# EAGLE design wachcio_meteo (EAGLE 7.7.0)

## Sheet 1 of 3: urzadzenie
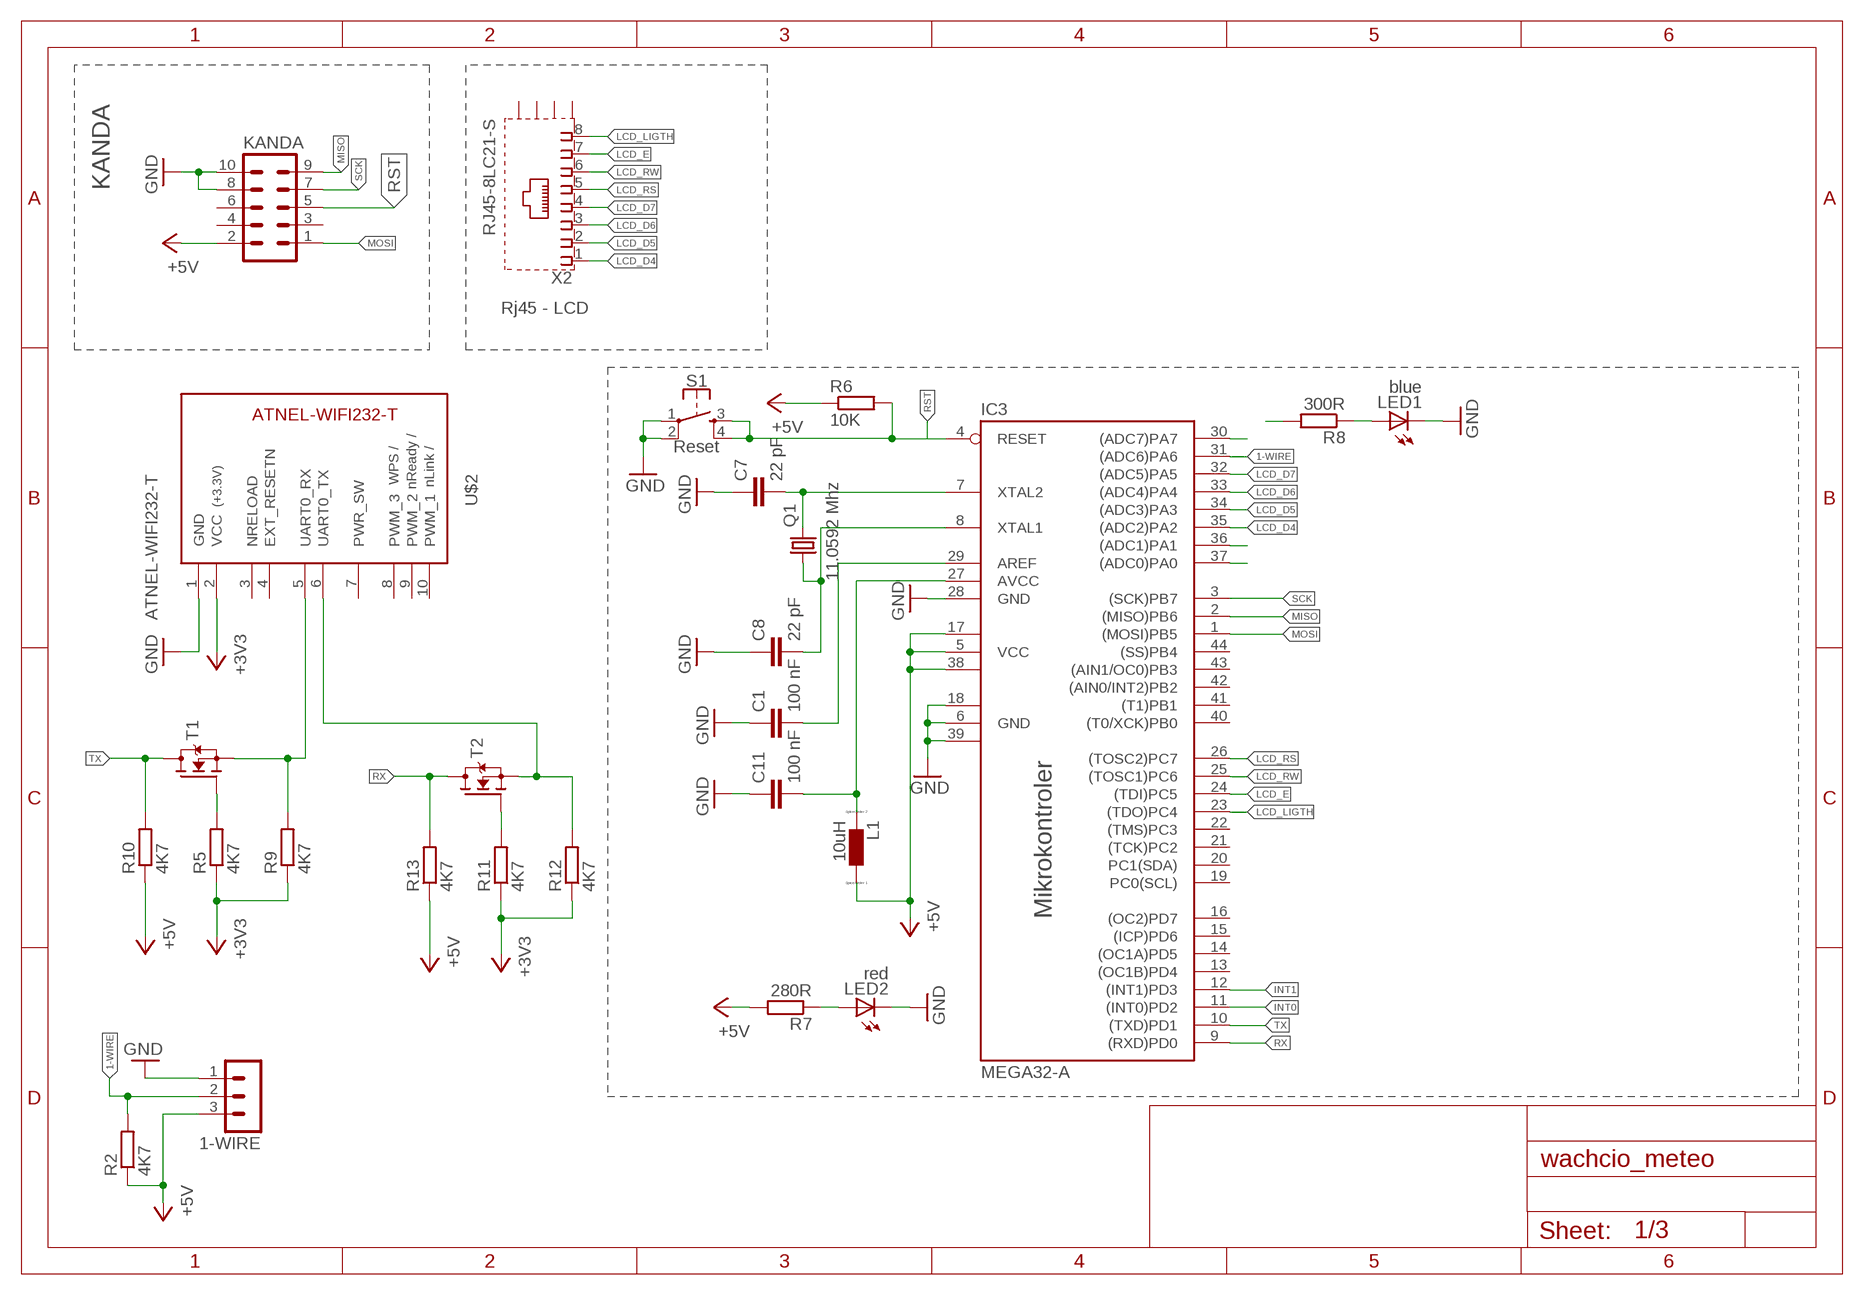
[diagram p0: schematic, sheet 1]

### Parts
1-WIRE  MA03-1  [MA03-1]
C1  100 nF  C-EUC0805  [C0805]
C7  22 pF  C-EUC0805  [C0805]
C8  22 pF  C-EUC0805  [C0805]
C11  100 nF  C-EUC0805  [C0805]
IC3  MEGA32-A  [TQFP44]
KANDA  ML10  [ML10]
L1  10uH  LL3230M  [L3230M]
LED1  blue  LEDCHIPLED_1206  [CHIPLED_1206]
LED2  red  LEDCHIPLED_1206  [CHIPLED_1206]
Q1  11.0592 Mhz  CRYSTALSM49  [SM49]
R2  4K7  R-EU_R1206W  [R1206W]
R5  4K7  R-EU_R1206W  [R1206W]
R6  10K  R-EU_R1206W  [R1206W]
R7  280R  R-EU_R1206W  [R1206W]
R8  300R  R-EU_R1206W  [R1206W]
R9  4K7  R-EU_R1206W  [R1206W]
R10  4K7  R-EU_R1206W  [R1206W]
R11  4K7  R-EU_R1206W  [R1206W]
R12  4K7  R-EU_R1206W  [R1206W]
R13  4K7  R-EU_R1206W  [R1206W]
S1  Reset  MOMENTARY-SWITCH-SPST-2-SMD-4.6X2.8MM  [TACTILE_SWITCH_SMD_4.6X2.8MM]
T1  MOSFET-N-SOT23  [SOT23]
T2  MOSFET-N-SOT23  [SOT23]
U$2  ATNEL-WIFI232-T  [ATNEL-WIFI232-T]
X2  RJ45-8LC21-S  [RJ45-SHIELD1]

### Nets
1-WIRE: 1-WIRE.2 IC3.31((ADC6)PA6) R2.2
+3V3: R5.1 R9.1 R11.1 R12.1 U$2.2(VCC) ; also sheet 2,3
+5V: 1-WIRE.3 IC3.5(VCC) IC3.17(VCC1) IC3.38(VCC2) KANDA.2 L1.1 R2.1 R6.1 R7.2 R10.1 R13.1 ; also sheet 2,3
GND: 1-WIRE.1 C1.1 C7.1 C8.1 C11.1 IC3.6(GND) IC3.18(GND1) IC3.28(GND) IC3.39(GND2) KANDA.8 KANDA.10 LED1.C LED2.C S1.1 S1.2 U$2.1(GND) ; also sheet 2,3
INT0: IC3.11((INT0)PD2)
INT1: IC3.12((INT1)PD3)
LCD_D4: IC3.35((ADC2)PA2) X2.1
LCD_D5: IC3.34((ADC3)PA3) X2.2
LCD_D6: IC3.33((ADC4)PA4) X2.3
LCD_D7: IC3.32((ADC5)PA5) X2.4
LCD_E: IC3.24((TDI)PC5) X2.7
LCD_LIGTH: IC3.23((TDO)PC4) X2.8
LCD_RS: IC3.26((TOSC2)PC7) X2.5
LCD_RW: IC3.25((TOSC1)PC6) X2.6
MISO: IC3.2((MISO)PB6) KANDA.9
MOSI: IC3.1((MOSI)PB5) KANDA.1
N$1: R9.2 T1.2(S) U$2.5(UART0_RX)
N$2: C11.2 IC3.27(AVCC) L1.2
N$3: C1.2 IC3.29(AREF)
N$6: R5.2 T1.1(G)
N$8: IC3.37((ADC0)PA0)
N$9: R12.2 T2.2(S) U$2.6(UART0_TX)
N$10: C7.2 IC3.7(XTAL2) Q1.2
N$11: C8.2 IC3.8(XTAL1) Q1.1
N$12: LED2.A R7.1
N$16: LED1.A R8.1
N$17: R8.2
N$21: IC3.36((ADC1)PA1)
N$22: R11.2 T2.1(G)
N$29: IC3.30((ADC7)PA7)
RST: IC3.4(RESET) KANDA.5 R6.2 S1.3 S1.4
RX: IC3.9((RXD)PD0) R13.2 T2.3(D)
SCK: IC3.3((SCK)PB7) KANDA.7
TX: IC3.10((TXD)PD1) R10.2 T1.3(D)
Unconnected: IC3.13((OC1B)PD4) IC3.14((OC1A)PD5) IC3.15((ICP)PD6) IC3.16((OC2)PD7) IC3.19(PC0(SCL)) IC3.20(PC1(SDA)) IC3.21((TCK)PC2) IC3.22((TMS)PC3) IC3.40((T0/XCK)PB0) IC3.41((T1)PB1) IC3.42((AIN0/INT2)PB2) IC3.43((AIN1/OC0)PB3) IC3.44((SS)PB4) KANDA.3 KANDA.4 KANDA.6 U$2.3(NRELOAD) U$2.4(EXT_RESETN) U$2.7(PWR_SW) U$2.8(PWM_3) U$2.9(PWM_2) U$2.10(PWM_1) X2.S1(S) X2.S2(S) X2.S3(S) X2.S4(S)

### Notes on the sheet
- KANDA
- Rj45 - LCD
- Mikrokontroler

## Sheet 2 of 3: zasilanie
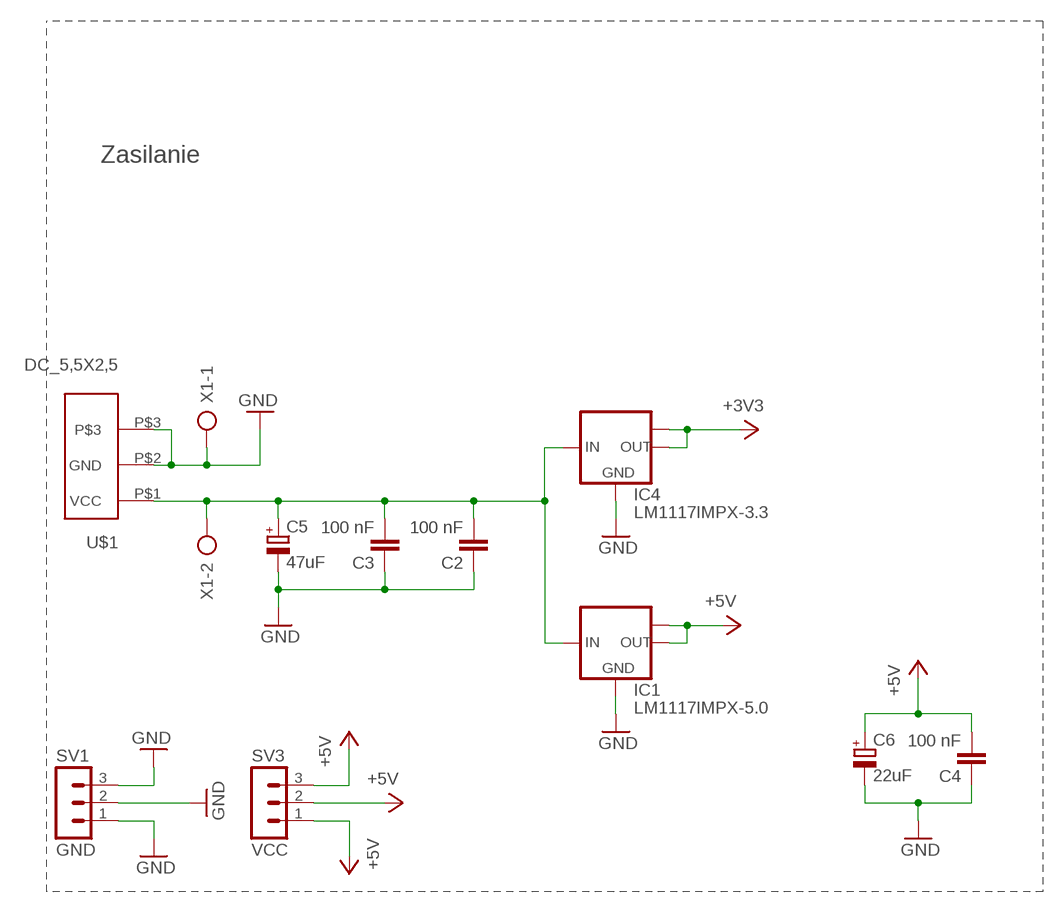
[diagram p1: schematic, sheet 2]

### Parts
C2  100 nF  C-EUC0805  [C0805]
C3  100 nF  C-EUC0805  [C0805]
C4  100 nF  C-EUC0805  [C0805]
C5  47uF  CPOL-EUB45181A  [B45181A]
C6  22uF  CPOL-EUB45181A  [B45181A]
IC1  LM1117IMPX-5.0  [SOT223]
IC4  LM1117IMPX-3.3  [SOT223]
SV1  GND  MA03-1  [MA03-1]
SV3  VCC  MA03-1  [MA03-1]
U$1  DC_5,5X2,5  [DC_5,5X2,5]
X1  AK500/2  [AK500/2]

### Nets
+3V3: IC4.2(OUT) IC4.TAB(OUT1) ; also sheet 1,3
+5V: C4.2 C6.+ IC1.2(OUT) IC1.TAB(OUT1) SV3.1 SV3.2 SV3.3 ; also sheet 1,3
+9V: C2.2 C3.2 C5.+ IC1.3(IN) IC4.3(IN) U$1.P$1(VCC) X1.2
GND: C2.1 C3.1 C4.1 C5.- C6.- IC1.1(GND) IC4.1(GND) SV1.1 SV1.2 SV1.3 U$1.P$2(GND) U$1.P$3 X1.1 ; also sheet 1,3

### Notes on the sheet
- Zasilanie

## Sheet 3 of 3: I2C
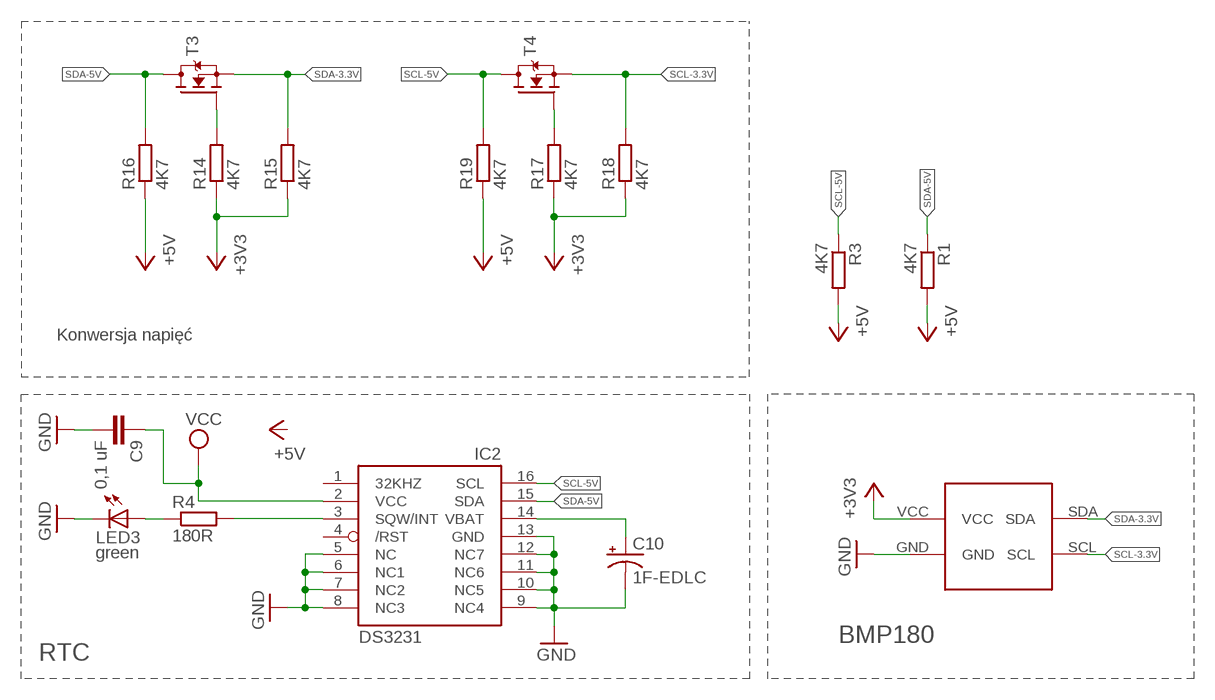
[diagram p2: schematic, sheet 3]

### Parts
C9  0,1 uF  C-EUC0805  [C0805]
C10  1F-EDLC  [CAP-RADIAL-5MM-21.5MM]
IC2  DS3231/SO  [SO16W]
LED3  green  LEDCHIPLED_1206  [CHIPLED_1206]
R1  4K7  R-EU_R1206W  [R1206W]
R3  4K7  R-EU_R1206W  [R1206W]
R4  180R  R-EU_R1206W  [R1206W]
R14  4K7  R-EU_R1206W  [R1206W]
R15  4K7  R-EU_R1206W  [R1206W]
R16  4K7  R-EU_R1206W  [R1206W]
R17  4K7  R-EU_R1206W  [R1206W]
R18  4K7  R-EU_R1206W  [R1206W]
R19  4K7  R-EU_R1206W  [R1206W]
T3  MOSFET-N-SOT23  [SOT23]
T4  MOSFET-N-SOT23  [SOT23]
U$3  BMP180  [BMP180]

### Nets
+3V3: R14.1 R15.1 R17.1 R18.1 U$3.VCC ; also sheet 1,2
+5V: R1.2 R3.2 R16.1 R19.1 ; also sheet 1,2
GND: C9.2 C10.- IC2.5(NC) IC2.6(NC1) IC2.7(NC2) IC2.8(NC3) IC2.9(NC4) IC2.10(NC5) IC2.11(NC6) IC2.12(NC7) IC2.13(GND) LED3.C U$3.GND ; also sheet 1,2
N$4: LED3.A R4.1
N$5: IC2.3(SQW/INT) R4.2
N$7: C10.+ IC2.14(VBAT)
N$25: R14.2 T3.1(G)
N$27: R17.2 T4.1(G)
SCL-3.3V: R18.2 T4.2(S) U$3.SCL
SCL-5V: IC2.16(SCL) R3.1 R19.2 T4.3(D)
SDA-3.3V: R15.2 T3.2(S) U$3.SDA
SDA-5V: IC2.15(SDA) R1.1 R16.2 T3.3(D)
VCC: C9.1 IC2.2(VCC)
Unconnected: IC2.1(32KHZ) IC2.4(/RST)

### Notes on the sheet
- Konwersja napięć
- BMP180
- RTC

## Library data of the parts
1-WIRE SV1 SV3 = con-lstb:MA03-1: PIN HEADER; OC_FARNELL: unknown; OC_NEWARK: unknown
C1-C4 C7-C9 C11 = rcl:C-EU: CAPACITOR, European symbol
C5 C6 = rcl:CPOL-EU: POLARIZED CAPACITOR, European symbol
C10 = SparkFun-Capacitors:1F-EDLC: [Eaton] [KR-5R5C105-R] - [1F Electric Double Layer Capacitor (SuperCapacitor)] This is a 21.5mm OD 1F SuperCapacitor.; PROD_ID: CAP-13904
IC1 IC4 = lm1117:LM1117IMPX-*
IC2 = adafruit:DS3231
IC3 = atmel:MEGA32: MICROCONTROLLER 32 Kbytes FLASH 2 Kbytes SRAM 1 Kbytes EEPROM USART 8-channel 10 bit ADC Source: www.atmel.com .. doc2503.pdf; MPN: ATMEGA32-16AU; OC_FARNELL: 9171274; OC_NEWARK: 69K6677
KANDA = con-harting-ml:ML10: HARTING; OC_FARNELL: unknown; OC_NEWARK: unknown
L1 = eagle-ltspice:L: INDUCTOR, European symbol; SPICEMODEL: NONE; SPICEPREFIX: L
LED1-LED3 = adafruit:LED: LED OSRAM: - CHIPLED LG R971, LG N971, LY N971, LG Q971, LY Q971, LO R971, LY R971 LH N974, LH R974 LS Q976, LO Q976, LY Q976 LO Q996 - Hyper CHIPLED LW Q18S LB Q993, LB Q99A, LB R99A - SideLED LS A670, LO A670, LY A670, LG A670, LP A670 LB A673, LV A673, LT A673, LW A673 LH A674 LY A675 LS A676, LA A676, LO A676, LY A676, LW A676 LS A679, LY A679, LG A679 - Hyper Micro SIDELED® LS Y876, LA Y876, LO Y876, LY Y876 LT Y87S - SmartLED LW L88C, LW L88S LB L89C, LB L89S, LG L890 LS L89K, LO L89K, LY L89K LS L896, LA L896, LO L896, LY L896 - TOPLED LS T670, LO T670, LY T670, LG T670, LP T670 LSG T670, LSP T670, LSY T670, LOP T670, LYG T670 LG T671, LOG T671, LSG T671 LB T673, LV T673, LT T673, LW T673 LH T674 LS T676, LA T676, LO T676, LY T676, LB T676, LH T676, LSB T676, LW T676 LB T67C, LV T67C, LT T67C, LS T67K, LO T67K, LY T67K, LW E67C LS E67B, LA E67B, LO E67B, LY E67B, LB E67C, LV E67C, LT E67C LW T67C LS T679, LY T679, LG T679 LS T770, LO T770, LY T770, LG T770, LP T770 LB T773, LV T773, LT T773, LW T773 LH T774 LS E675, LA E675, LY E675, LS T675 LS T776, LA T776, LO T776, LY T776, LB T776 LHGB T686 LT T68C, LB T68C - Hyper Mini TOPLED® LB M676 - Mini TOPLED Santana® LG M470 LS M47K, LO M47K, LY M47K Source: http://www.osram.convergy.de/
Q1 = adafruit:CRYSTAL: CRYSTAL; OC_FARNELL: unknown; OC_NEWARK: unknown
R1-R19 = resistor:R-EU_: RESISTOR, European symbol
S1 = SparkFun-Switches:MOMENTARY-SWITCH-SPST-2: Momentary Switch (Pushbutton) - SPST - Two Circuits Normally-open (NO) SPST momentary switches (buttons, pushbuttons). Schematic symbol includes two switch circuits. Variants SMD-4.6MMX2.8MM - 4.60mm x 2.80mm Tactile Momentary Button Switch - Used on SparkFun SAMD21 Mini Breakout <https://www.sparkfun.com/products/13664> SMD-5.2MM - Mini Pushbutton Switch - SMD <https://www.sparkfun.com/products/8720> - Used on Arduino Pro Mini <https://www.sparkfun.com/products/11114>; PROD_ID: SWCH-13065
T1-T4 = we-transistor:MOSFET-N: N-Channel MOSFET SOT23 N-Chn MOSFET TSM3404, IRLML2502 (Vgs>=+/-20V, Vds<=20V, Id>=3A + Rds<=0.05Ohm @ Vgs=4.5V) BSS138 (Vgs>=+/-20V, Vds<=40V, Id>=0.2A + Rds<=3Ohm @ Vgs=4.5V) SOT223 Low Side Switch with Protection (Infineon) BSP76 (Vin=0...10V, Vds<=42V, Id=1.4A + Rds=0.2Ohm @ Vin=5V) BSP77 (Vin=0...10V, Vds<=42V, Id=2.2A + Rds=0.1Ohm @ Vin=5V) D²Pak Low Side Switch with Protection (Infineon) BTS117TC (Vin=0...10V, Vds<=60V, Id=3.5A + Rds=0.12Ohm @ Vin=5V) BTS133TC (Vin=0...10V, Vds<=60V, Id=7A + Rds=0.06Ohm @ Vin=5V) BTS141TC (Vin=0...10V, Vds<=60V, Id=12A + Rds=0.03Ohm @ Vin=5V) BTS3018TC (Vin=0...10V, Vds<=60V, Id=6A + Rds=0.02Ohm @ Vin=5V)
U$1 = wachcio:DC_5,5X2,5
U$2 = ATNEL-WIFI232-T:ATNEL-WIFI232-T
U$3 = boards:BMP180
X1 = con-ptr500:AK500/2: CONNECTOR; OC_FARNELL: unknown; OC_NEWARK: unknown
X2 = con-tycoelectronics:RJ45*2: RJ45 Low Profile Shield Type 2 For all RJ45 L, LC, LCT and X Series Models Source: www.tycoelectronics.com .. ENG_DS_1654001_1099_RJ_L_0507.pdf; OC_FARNELL: unknown; OC_NEWARK: unknown

## Board
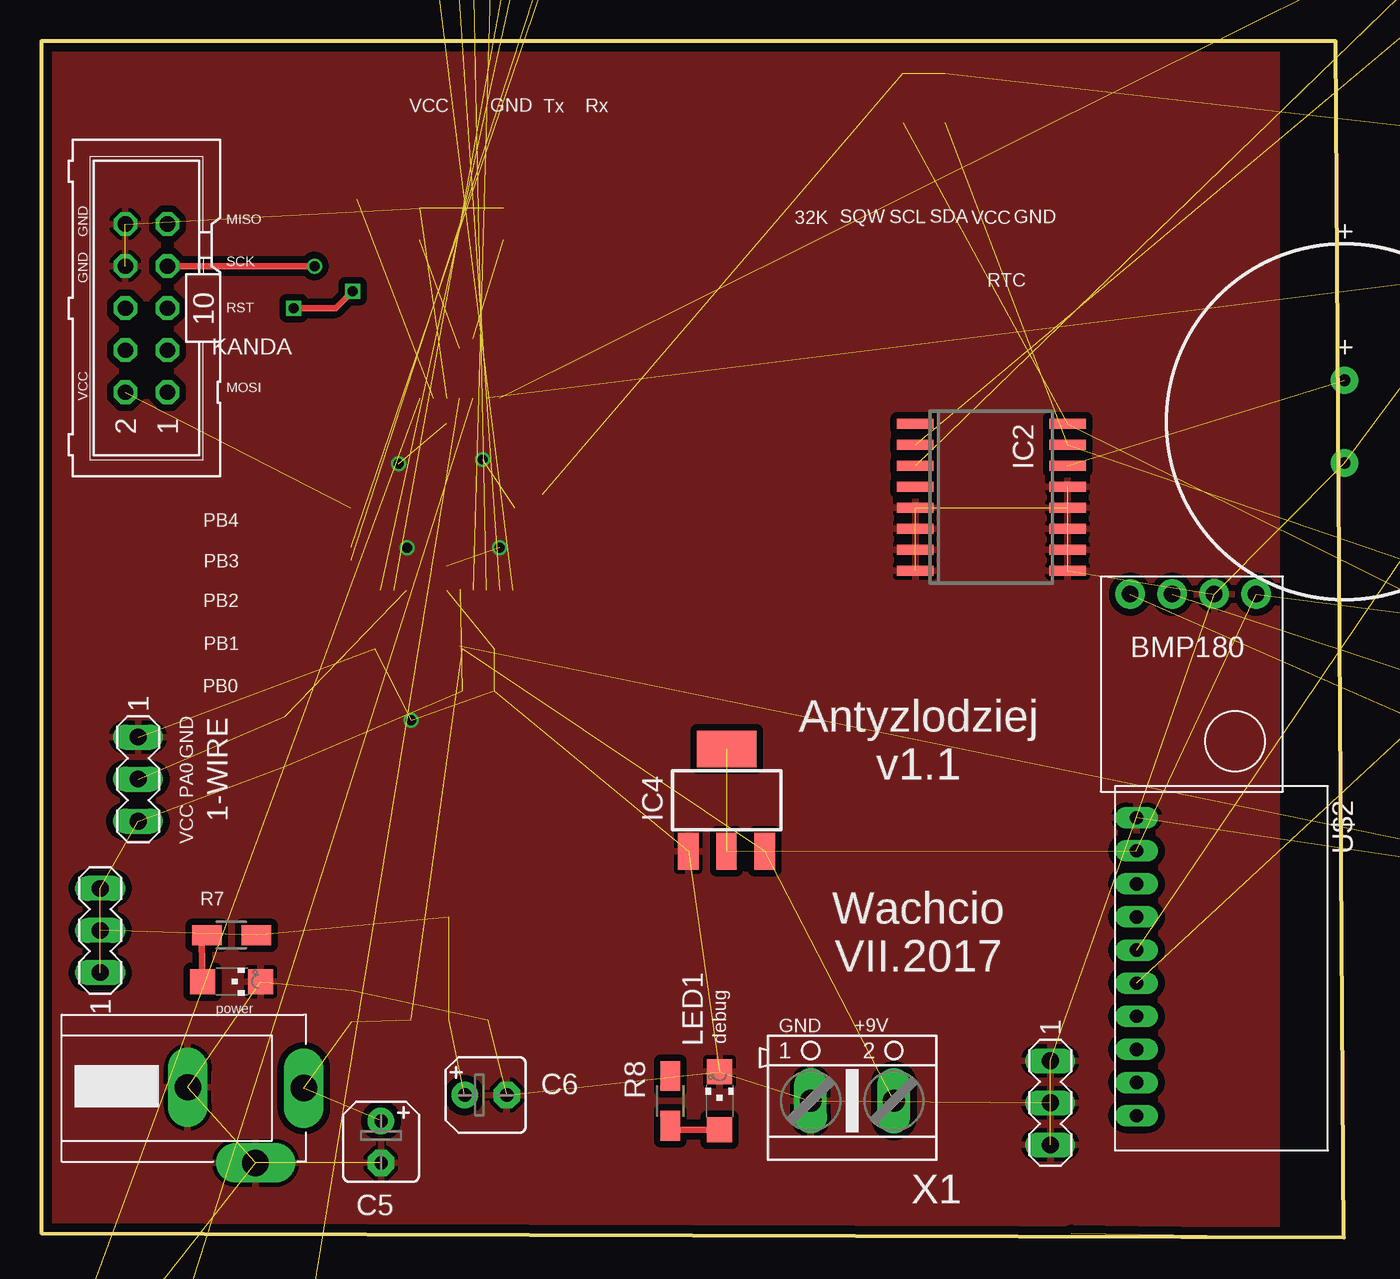
[diagram p3: board, top side]
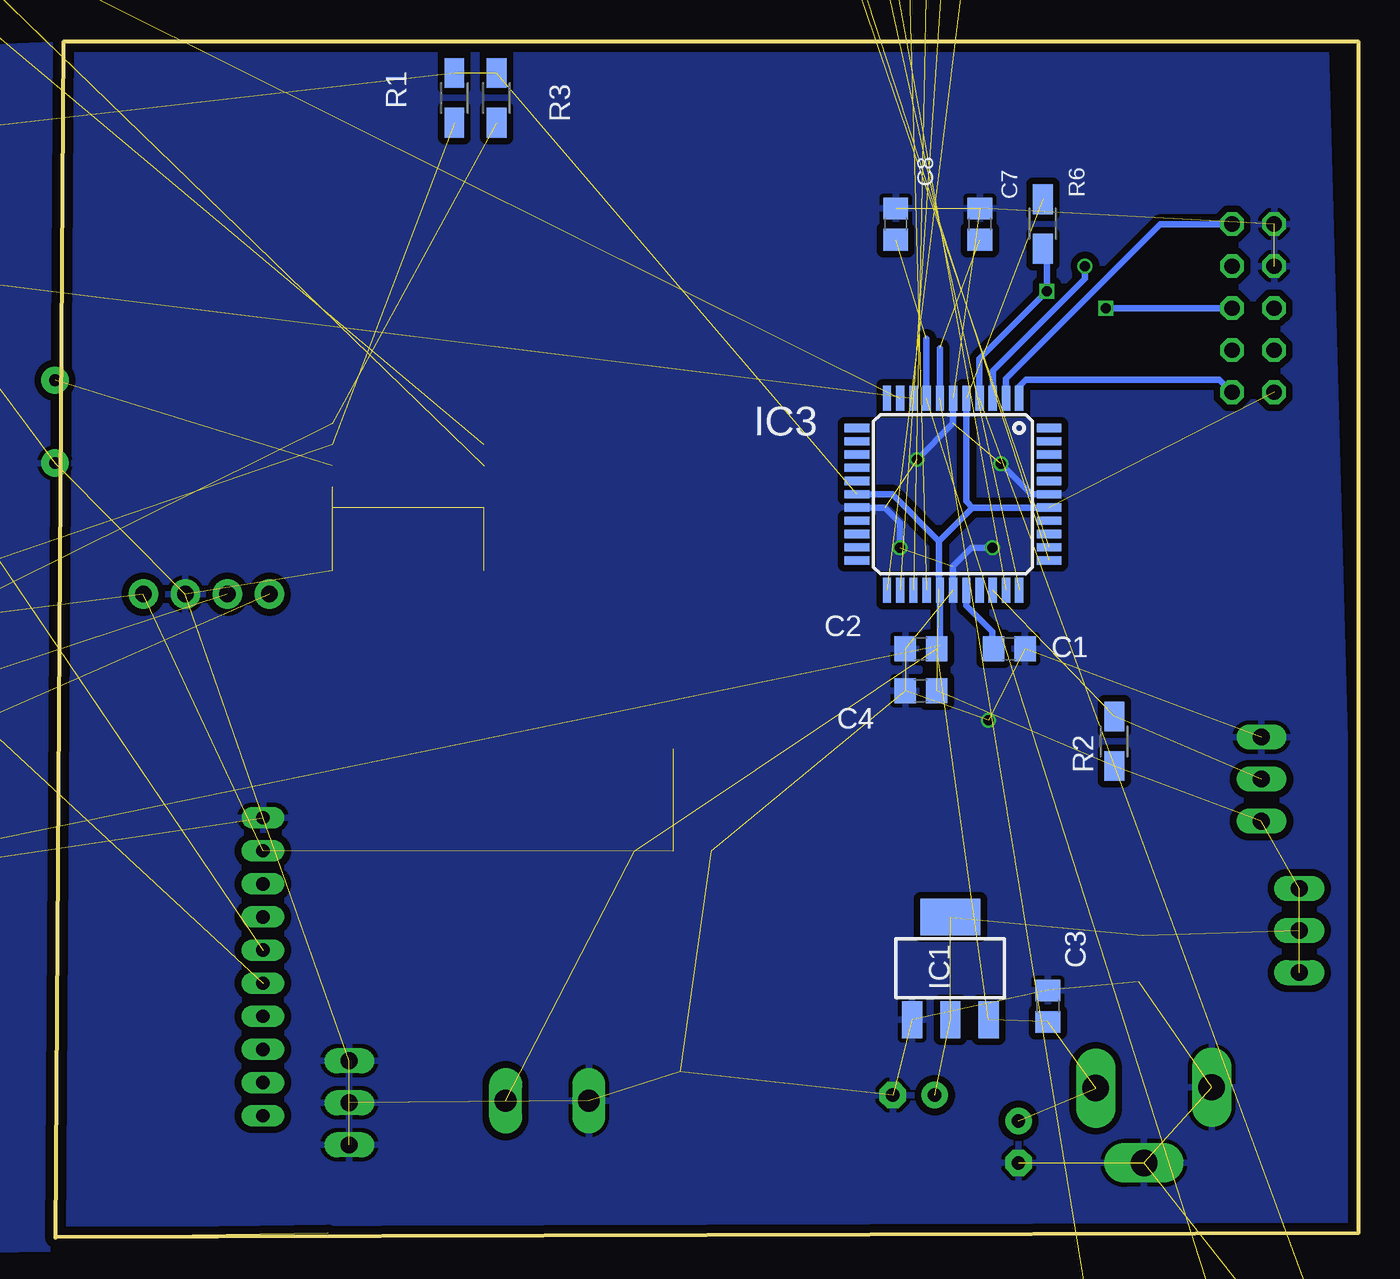
[diagram p4: board, bottom side, seen from below]

Size 78.71 x 72.25 mm. Coordinates in mm from the lower left corner, seen from the top.
Outline: 62.23,0.25 78.71,0
Outline: 78.71,0 0,0.25 0,72.25 78.2,72.25 78.71,0
Copper layers (1*16): Top 0.035mm / dielectric 1.5mm / Bottom 0.035mm
Design rules "smart-prototyping *": minimum track width 7mil, minimum drill 12mil, track to track 7mil, track to pad 7mil, pad to pad 7mil, via to via 7mil, smd to smd 0mil, copper to edge 20mil, drill to drill 10mil, minimum pad ring 10mil, minimum via ring 6mil, stop-mask expansion 2mil, vias tented up to drill 0mil, thermal gap 10mil

### Footprints (pad centres in the part's own frame; a part is rotated, then mirrored left to right if it is on the bottom)
MA03-1 = drill 1.016 long: 1 -2.54,0; 2 0,0; 3 2.54,0
C0805 = smd 1.3 x 1.5: 1 -0.95,0; 2 0.95,0
B45181A = drill 0.813 pad 1.6: + -1.27,0 | drill 0.813 pad 1.6 octagon: - 1.27,0
CAP-RADIAL-5MM-21.5MM = drill 0.7 pad 1.651: + -2.5,0; - 2.5,0
SOT223 = smd 1.219 x 2.235: 1 -2.311,-3.099; 2 0,-3.099; 3 2.311,-3.099 | smd 3.6 x 2.2: TAB 0,3.099
SO16W = smd 0.6 x 2.2: 1 -4.445,-4.6; 2 -3.175,-4.6; 3 -1.905,-4.6; 4 -0.635,-4.6; 5 0.635,-4.6; 6 1.905,-4.6; 7 3.175,-4.6; 8 4.445,-4.6; 9 4.445,4.6; 10 3.175,4.6; 11 1.905,4.6; 12 0.635,4.6; 13 -0.635,4.6; 14 -1.905,4.6; 15 -3.175,4.6; 16 -4.445,4.6
TQFP44 = smd 1.5 x 0.5: 1 -5.8,4; 2 -5.8,3.2; 3 -5.8,2.4; 4 -5.8,1.6; 5 -5.8,0.8; 6 -5.8,0; 7 -5.8,-0.8; 8 -5.8,-1.6; 9 -5.8,-2.4; 10 -5.8,-3.2; 11 -5.8,-4; 23 5.8,-4; 24 5.8,-3.2; 25 5.8,-2.4; 26 5.8,-1.6; 27 5.8,-0.8; 28 5.8,0; 29 5.8,0.8; 30 5.8,1.6; 31 5.8,2.4; 32 5.8,3.2; 33 5.8,4 | smd 0.5 x 1.5: 12 -4,-5.8; 13 -3.2,-5.8; 14 -2.4,-5.8; 15 -1.6,-5.8; 16 -0.8,-5.8; 17 0,-5.8; 18 0.8,-5.8; 19 1.6,-5.8; 20 2.4,-5.8; 21 3.2,-5.8; 22 4,-5.8; 34 4,5.8; 35 3.2,5.8; 36 2.4,5.8; 37 1.6,5.8; 38 0.8,5.8; 39 0,5.8; 40 -0.8,5.8; 41 -1.6,5.8; 42 -2.4,5.8; 43 -3.2,5.8; 44 -4,5.8
ML10 = drill 0.914 octagon: 1 -5.08,-1.27; 2 -5.08,1.27; 3 -2.54,-1.27; 4 -2.54,1.27; 5 0,-1.27; 6 0,1.27; 7 2.54,-1.27; 8 2.54,1.27; 9 5.08,-1.27; 10 5.08,1.27
L3230M = smd 1.6 x 2.2: 1 -1.4,0; 2 1.4,0
CHIPLED_1206 = smd 1.5 x 1.5: A 0,-1.75; C 0,1.75
SM49 = smd 5.08 x 1.778: 1 -4.826,0; 2 4.826,0
R1206W = smd 1.8 x 1.2: 1 -1.499,0; 2 1.499,0
TACTILE_SWITCH_SMD_4.6X2.8MM = smd 0.9 x 1: 1 -2.05,-0.8; 2 2.05,-0.8; 3 2.05,0.8; 4 -2.05,0.8
SOT23 = smd 1.3 x 0.9: 1 -1.1,0.95; 2 -1.1,-0.95; 3 1.1,0
DC_5,5X2,5 = drill 1.6 long: P$1 14.605,4.445; P$2 11.7,-0.07; P$3 7.6,4.5
ATNEL-WIFI232-T = drill 0.8 pad 1.27 long: 1 -9.1,-5.45; 2 -7.1,-5.45; 3 -5.1,-5.45; 4 -3.1,-5.45; 5 -1.1,-5.45; 6 0.9,-5.45; 7 2.9,-5.45; 8 4.9,-5.45; 9 6.9,-5.45; 10 8.9,-5.45
BMP180 = drill 1 pad 1.778: GND 1.27,5.08; SCL -1.27,5.08; SDA -3.81,5.08; VCC 3.81,5.08
AK500/2 = drill 1.321 long: 1 -2.515,0; 2 2.515,0
RJ45-SHIELD1 = drill 0.9 pad 1.4: 1 -4.445,6.35; 2 -3.175,8.89; 3 -1.905,6.35; 4 -0.635,8.89; 5 0.635,6.35; 6 1.905,8.89; 7 3.175,6.35; 8 4.445,8.89 | drill 1.9 pad 2.5: S1 -8.763,-3.048; S2 8.763,-3.048; S3 -8.128,8.76; S4 8.128,8.76 | hole 3.251: -5.715,0; 5.715,0

### Placement (x,y rotation side)
1-WIRE  5.84,27.69 270 top
C1  21.08,35.56 180 bottom
C2  26.42,35.56 0 bottom
C3  18.75,13.97 270 bottom
C4  26.42,33.02 0 bottom
C5  20.53,5.77 270 top
C6  26.85,8.6 0 top
C7  22.86,61.21 270 bottom
C8  27.94,61.21 270 bottom
C9  119.89,103.38 0 top  (outside the outline)
C10  78.74,49.28 270 top
C11  95.76,21.08 0 top  (outside the outline)
IC1  24.64,16.26 0 bottom
IC2  57.4,44.7 270 top
IC3  24.48,44.89 270 bottom
IC4  41.4,26.42 0 top
KANDA  6.35,56.13 90 top
L1  109.47,13.72 0 top  (outside the outline)
LED1  40.98,8.25 0 top
LED2  11.5,15.45 270 top
LED3  120.9,108.97 0 top  (outside the outline)
Q1  9.4,-17.02 0 top  (outside the outline)
R1  54.61,68.83 90 bottom
R2  14.73,29.97 90 bottom
R3  52.07,68.83 90 bottom
R4  122.43,115.57 0 top  (outside the outline)
R5  122.43,93.22 0 top  (outside the outline)
R6  19.05,61.21 270 bottom
R7  11.5,18.25 0 top
R8  38,8.25 90 top
R9  122.43,87.12 0 top  (outside the outline)
R10  122.43,81.03 0 top  (outside the outline)
R11  122.43,74.93 0 top  (outside the outline)
R12  122.43,68.83 0 top  (outside the outline)
R13  122.43,62.74 0 top  (outside the outline)
R14  122.43,32.77 0 top  (outside the outline)
R15  131.57,32.77 0 top  (outside the outline)
R16  122.43,26.67 0 top  (outside the outline)
R17  131.57,26.67 0 top  (outside the outline)
R18  122.43,20.57 0 top  (outside the outline)
R19  131.57,20.57 0 top  (outside the outline)
S1  -1.27,-10.16 0 top  (outside the outline)
SV1  60.96,8.13 270 top
SV3  3.56,18.54 90 top
T1  121.16,97.79 0 top  (outside the outline)
T2  121.16,58.17 0 top  (outside the outline)
T3  121.16,16 0 top  (outside the outline)
T4  127.76,16 0 top  (outside the outline)
U$1  1.24,4.57 0 top
U$2  71.63,16.26 270 top
U$3  69.6,33.78 0 top
X1  49,8.25 0 top
X2  27.94,88.14 180 top  (outside the outline)

### Tracks (layer width: path | path; a pad name or v marks a point on that pad's centre or on a via)
1-WIRE  (2 unrouted)
+3V3  (11 unrouted)
+5V  (19 unrouted)
  Bottom 0.406: IC3.17 28.15,44.89 25.32,42.06 | 25.32,42.06 25.32,39.14 | IC3.38 23.3,44.09 | 23.3,44.09 25.32,42.06 | IC3.5 23.68,44.47 23.3,44.09
+9V  (7 unrouted)
GND  (via drill 0.6)  (42 unrouted)
  Bottom 0.406: IC3.39 19.75,44.89 v21.59,46.74 | IC3.6 24.48,49.18 v26.67,46.99 | IC3.18 28.6,44.09 27.69,43.18 v27.69,41.66 | IC3.28 24.48,40.55 23.37,41.66 v22.1,41.66
  other vias: 22.35,31.24
  pour Bottom (isolate 0.406, rank 4): 0,0.25 2.03,75.29 86.07,71.74 86.07,-0.76
  pour Top (isolate 0.406): 0,0.25 0,73.26 74.64,73.26 74.64,0.25
LCD_D4  (1 unrouted)
LCD_D5  (1 unrouted)
LCD_D6  (1 unrouted)
LCD_D7  (1 unrouted)
LCD_E  (1 unrouted)
LCD_LIGTH  (1 unrouted)
LCD_RS  (1 unrouted)
LCD_RW  (1 unrouted)
MISO
  Bottom 0.406: IC3.2 21.28,51.88 11.94,61.21 KANDA.9
MOSI
  Bottom 0.406: IC3.1 20.48,51.41 20.07,51.82 8.38,51.82 KANDA.1
N$1  (2 unrouted)
N$2  (2 unrouted)
  Bottom 0.406: IC3.27 25.28,35.75
N$3
  Bottom 0.406: IC3.29 23.68,38.16 22.1,36.58 22.1,35.63 C1.2
N$4  (1 unrouted)
N$5  (1 unrouted)
N$6  (1 unrouted)
N$7  (1 unrouted)
N$9  (2 unrouted)
N$10  (2 unrouted)
  Bottom 0.406: IC3.7 25.28,53.72
N$11  (2 unrouted)
  Bottom 0.406: IC3.8 26.08,54.27
N$12
  Top 0.406: R7.1 9.68,17.8 LED2.A
N$16
  Top 0.406: LED1.A 38,6.5 R8.1
N$22  (1 unrouted)
N$25  (1 unrouted)
N$27  (1 unrouted)
RST  (via drill 0.6)  (2 unrouted)
  Top 0.406: v15.24,56.13 17.78,56.13 v18.8,57.15
  Bottom 0.406: KANDA.5 v15.24,56.13 | R6.2 18.8,59.46 v18.8,57.15 22.88,53.07 IC3.4
RX  (2 unrouted)
SCK  (via drill 0.6)
  Top 0.406: v16.51,58.67 KANDA.7
  Bottom 0.406: IC3.3 22.08,52.34 16.51,57.91 v16.51,58.67
SCL-3.3V  (2 unrouted)
SCL-5V  (3 unrouted)
SDA-3.3V  (2 unrouted)
SDA-5V  (3 unrouted)
TX  (2 unrouted)
VCC  (1 unrouted)

### Text on the board
tPlace: VCC | GND | Tx | Rx | RTC | power | GND | +9V | debug
tNames: MISO | 32K | SQW | SCL | SDA | VCC | GND | GND | SCK | GND | RST | MOSI | VCC | PB4 | PB3 | PB2 | PB1 | PB0 | GND | PA0 | VCC | Antyzlodziej / v1.1 / / / Wachcio / VII.2017